# EAGLE design URA (EAGLE 9.6.2)
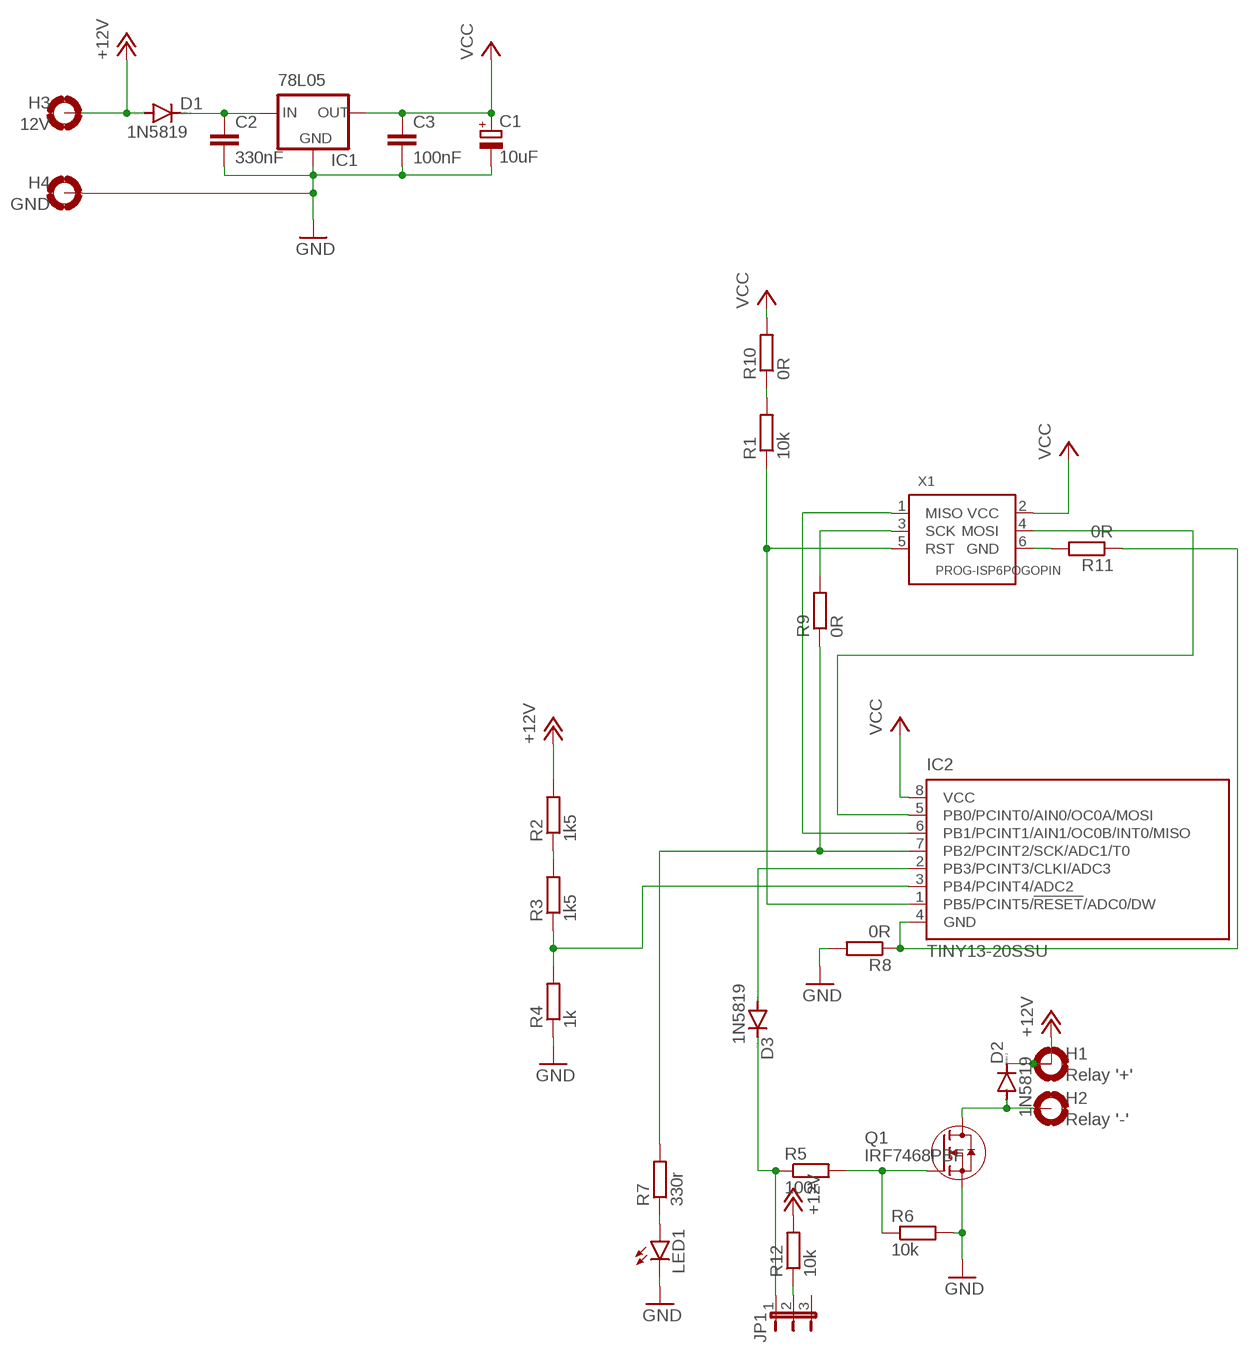
[diagram p0: schematic, sheet 1]

## Parts
C1  10uF  CPOL-EUCT3216  [CT3216]
C2  330nF  C-EUC0805K  [C0805K]
C3  100nF  C-EUC0805K  [C0805K]
D1  1N5819  CGRM4001-G  [SOD-123_MINI-SMA]
D2  1N5819  CGRM4001-G  [SOD-123_MINI-SMA]
D3  1N5819  CGRM4001-G  [SOD-123_MINI-SMA]
H1  Relay '+'  MOUNT-PAD-ROUND2.8  [2,8-PAD]
H2  Relay '-'  MOUNT-PAD-ROUND2.8  [2,8-PAD]
H3  12V  MOUNT-PAD-ROUND2.8  [2,8-PAD]
H4  GND  MOUNT-PAD-ROUND2.8  [2,8-PAD]
IC1  78L05  78LXXSOT89  [78LXX-SOT89]
IC2  TINY13-20SSU  [8S1]
JP1  JP2E  [JP2]
LED1  LEDCHIP-LED0805  [CHIP-LED0805]
Q1  IRF7468PBF  [SO08]
R1  10k  R-EU_R0805  [R0805]
R2  1k5  R-EU_R0805  [R0805]
R3  1k5  R-EU_R0805  [R0805]
R4  1k  R-EU_R0805  [R0805]
R5  100r  R-EU_R0805  [R0805]
R6  10k  R-EU_R0805  [R0805]
R7  330r  R-EU_R0805  [R0805]
R8  0R  R0_1206  [R1206]
R9  0R  R0_1206  [R1206]
R10  0R  R0_1206  [R1206]
R11  0R  R0_1206  [R1206]
R12  10k  R-EU_R0805  [R0805]
X1  PROG-ISP6POGOPIN  [PROG_POGOPIN]

## Nets
+12V: D1.A D2.C H1.B2,8(MOUNT) H3.B2,8(MOUNT) R2.2 R12.2
GND: C1.- C2.2 C3.2 H4.B2,8(MOUNT) IC1.GND@0(GND) IC1.GND@1(GND) LED1.C Q1.1(S) Q1.2(S) Q1.3(S) R4.1 R6.2 R8.2
N$1: IC2.6(PB1/PCINT1/AIN1/OC0B/INT0/MISO) X1.1(MISO)
N$2: IC2.5(PB0/PCINT0/AIN0/OC0A/MOSI) X1.4(MOSI)
N$3: IC2.1(PB5/PCINT5/!RESET!/ADC0/DW) R1.1 X1.5(RST)
N$4: C2.1 D1.C IC1.IN
N$5: IC2.7(PB2/PCINT2/SCK/ADC1/T0) R7.2 R9.1
N$6: R2.1 R3.2
N$7: IC2.3(PB4/PCINT4/ADC2) R3.1 R4.2
N$8: Q1.4(G) R5.2 R6.1
N$9: D3.A IC2.2(PB3/PCINT3/CLKI/ADC3)
N$10: D2.A H2.B2,8(MOUNT) Q1.5(D) Q1.6(D) Q1.7(D) Q1.8(D)
N$11: LED1.A R7.1
N$12: D3.C JP1.1 R5.1
N$13: R9.2 X1.3(SCK)
N$14: R1.2 R10.1
N$15: R11.2 X1.6(GND)
N$16: IC2.4(GND) R8.1 R11.1
N$27: JP1.2 R12.1
VCC: C1.+ C3.1 IC1.OUT IC2.8(VCC) R10.2 X1.2(VCC)
Unconnected: JP1.3

## Library data of the parts
C1 = rcl:CPOL-EU: POLARIZED CAPACITOR, European symbol; SPICEPREFIX: C
C2 C3 = rcl:C-EU: CAPACITOR, European symbol; SPICEPREFIX: C
D1-D3 = diode:CGRM400*-G: Molded plasitc,JEDEC SOD-123/Mini SMA Source: Comchip CGRM4001-G.pdf
H1-H4 = holes:MOUNT-PAD-ROUND: MOUNTING PAD, round
IC1 = usb:78LXX: VOLTAGE REGULATOR
IC2 = usb:TINY13: 8-bit AVR Microcontroller with 1K Bytes In-System Programmable Flash Source: http://www.atmel.com/dyn/resources/prod_documents/2535S.pdf; MPN: ATTINY13-20SSU; OC_FARNELL: 1455133; OC_NEWARK: 58M3771
JP1 = jumper:JP2E: JUMPER
LED1 = led:LED: LED OSRAM: - CHIPLED LG R971, LG N971, LY N971, LG Q971, LY Q971, LO R971, LY R971 LH N974, LH R974 LS Q976, LO Q976, LY Q976 LO Q996 - Hyper CHIPLED LW Q18S LB Q993, LB Q99A, LB R99A - SideLED LS A670, LO A670, LY A670, LG A670, LP A670 LB A673, LV A673, LT A673, LW A673 LH A674 LY A675 LS A676, LA A676, LO A676, LY A676, LW A676 LS A679, LY A679, LG A679 - Hyper Micro SIDELED® LS Y876, LA Y876, LO Y876, LY Y876 LT Y87S - SmartLED LW L88C, LW L88S LB L89C, LB L89S, LG L890 LS L89K, LO L89K, LY L89K LS L896, LA L896, LO L896, LY L896 - TOPLED LS T670, LO T670, LY T670, LG T670, LP T670 LSG T670, LSP T670, LSY T670, LOP T670, LYG T670 LG T671, LOG T671, LSG T671 LB T673, LV T673, LT T673, LW T673 LH T674 LS T676, LA T676, LO T676, LY T676, LB T676, LH T676, LSB T676, LW T676 LB T67C, LV T67C, LT T67C, LS T67K, LO T67K, LY T67K, LW E67C LS E67B, LA E67B, LO E67B, LY E67B, LB E67C, LV E67C, LT E67C LW T67C LS T679, LY T679, LG T679 LS T770, LO T770, LY T770, LG T770, LP T770 LB T773, LV T773, LT T773, LW T773 LH T774 LS E675, LA E675, LY E675, LS T675 LS T776, LA T776, LO T776, LY T776, LB T776 LHGB T686 LT T68C, LB T68C - Hyper Mini TOPLED® LB M676 - Mini TOPLED Santana® LG M470 LS M47K, LO M47K, LY M47K Source: http://www.osram.convergy.de LUXEON: - LUMILED® LXK2-PW12-R00, LXK2-PW12-S00, LXK2-PW14-U00, LXK2-PW14-V00 LXK2-PM12-R00, LXK2-PM12-S00, LXK2-PM14-U00 LXK2-PE12-Q00, LXK2-PE12-R00, LXK2-PE12-S00, LXK2-PE14-T00, LXK2-PE14-U00 LXK2-PB12-K00, LXK2-PB12-L00, LXK2-PB12-M00, LXK2-PB14-N00, LXK2-PB14-P00, LXK2-PB14-Q00 LXK2-PR12-L00, LXK2-PR12-M00, LXK2-PR14-Q00, LXK2-PR14-R00 LXK2-PD12-Q00, LXK2-PD12-R00, LXK2-PD12-S00 LXK2-PH12-R00, LXK2-PH12-S00 LXK2-PL12-P00, LXK2-PL12-Q00, LXK2-PL12-R00 Source: www.luxeon.com KINGBRIGHT: KA-3528ASYC Source: www.kingbright.com
Q1 = usb:IRF7468PBF
R1-R7 R12 = rcl:R-EU_: RESISTOR, European symbol; SPICEPREFIX: R
R8-R11 = usb:R0_1206
X1 = usb:PROG-ISP

## Board
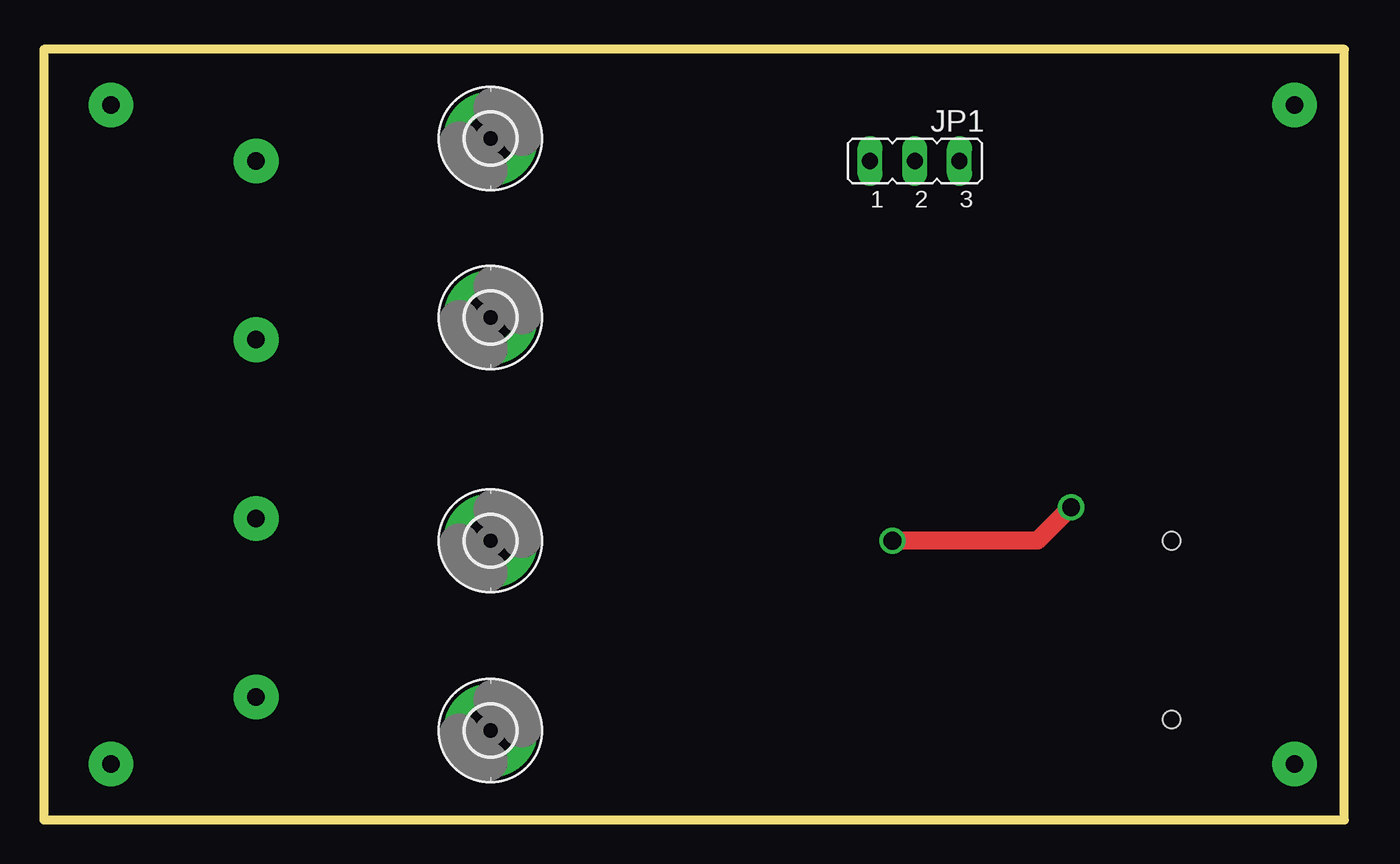
[diagram p1: board, top side]
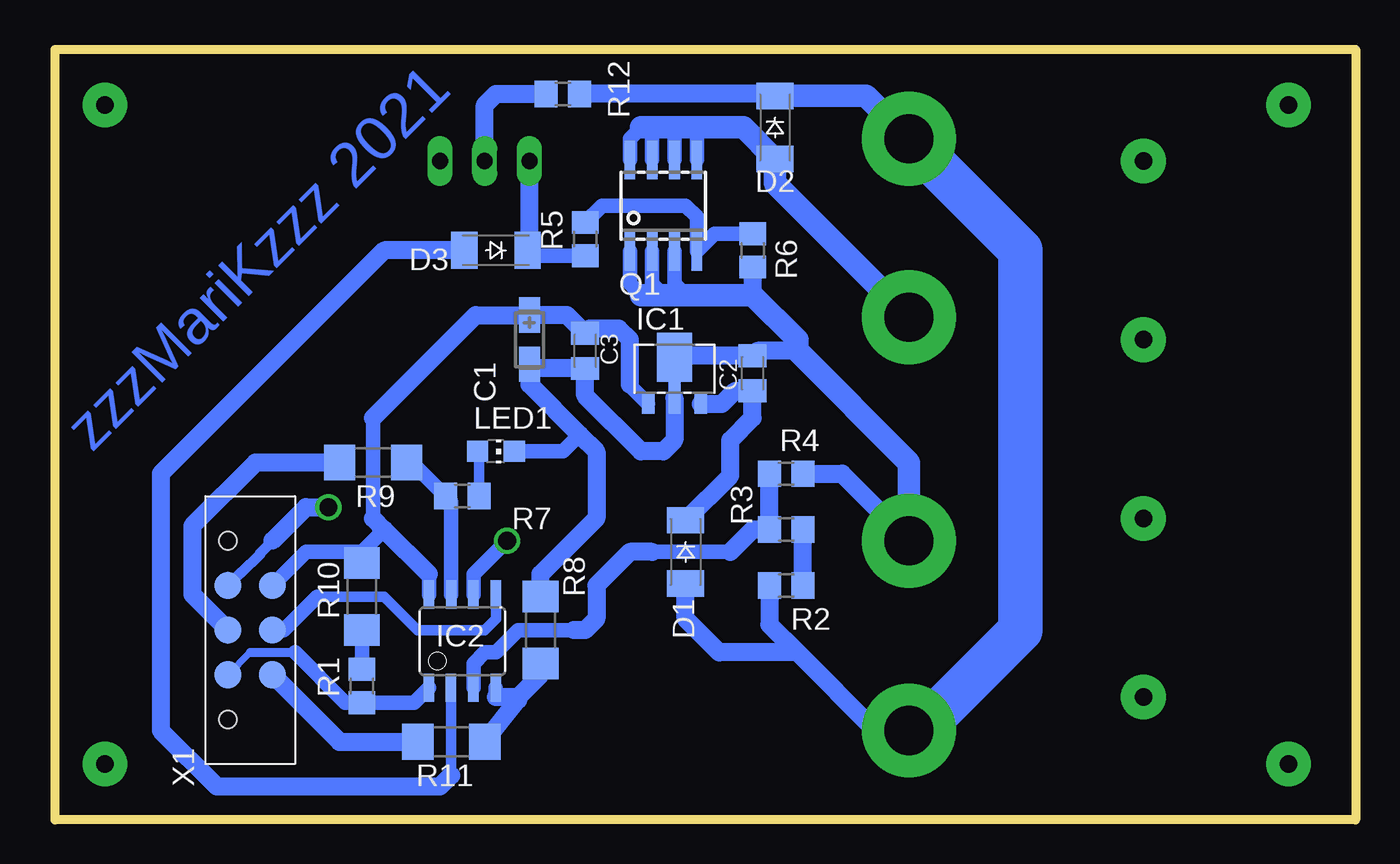
[diagram p2: board, bottom side, seen from below]

Size 73.97 x 43.8 mm. Coordinates in mm from the lower left corner, seen from the top.
Outline: 0,0 73.97,0 73.97,43.8 0,43.8 0,0
Copper layers (1*16): Top 0.035mm / dielectric 1.5mm / Bottom 0.035mm
Design rules "default": minimum track width 6mil, minimum drill 0.35mm, track to track 6mil, track to pad 6mil, pad to pad 6mil, via to via 6mil, smd to smd 6mil, copper to edge 40mil, drill to drill 6mil, minimum pad ring 10mil, minimum via ring 8mil, stop-mask expansion 4mil, vias tented up to drill 0mil, thermal gap 10mil

### Footprints (pad centres in the part's own frame; a part is rotated, then mirrored left to right if it is on the bottom)
CT3216 = smd 2 x 1.2: + -1.4,0; - 1.4,0
C0805K = smd 1.3 x 1.6: 1 -1,0; 2 1,0
SOD-123_MINI-SMA = smd 1.5 x 2.1: A 1.8,0; C -1.8,0
2,8-PAD = drill 2.8 pad 5.334: B2,8 0,0
78LXX-SOT89 = smd 0.7 x 1.8: GND@0 0,-1.4 | smd 2 x 2.8: GND@1 0,0.9 | smd 0.7 x 1.1: IN 1.5,-1.75; OUT -1.5,-1.75
8S1 = smd 0.6 x 1.6: 1 -1.905,-2.654; 2 -0.645,-2.654; 3 0.625,-2.654; 4 1.895,-2.654; 5 1.905,2.654; 6 0.635,2.654; 7 -0.635,2.654; 8 -1.905,2.654
JP2 = drill 0.914 long: 1 -2.54,0; 2 0,0; 3 2.54,0
CHIP-LED0805 = smd 1.2 x 1.2: A 0,-1.05; C 0,1.05
SO08 = smd 0.6 x 2.2: 1 -1.905,-2.6; 2 -0.635,-2.6; 3 0.635,-2.6; 4 1.905,-2.6; 5 1.905,2.6; 6 0.635,2.6; 7 -0.635,2.6; 8 -1.905,2.6
R0805 = smd 1.3 x 1.5: 1 -0.95,0; 2 0.95,0
R1206 = smd 1.778 x 2.032: 1 -1.905,0; 2 1.905,0
PROG_POGOPIN = smd 1.524 x 1.524: 1 0,7.62; 2 2.54,7.62; 3 0,5.08; 4 2.54,5.08; 5 0,2.54; 6 2.54,2.54 | hole 1.016: 0,0; 0,10.16

### Placement (x,y rotation side)
C1  46.99,27.3 270 bottom
C2  34.29,25.4 90 bottom
C3  43.81,26.67 270 bottom
D1  38.1,15.24 270 bottom
D2  33.02,39.37 270 bottom
D3  48.9,32.38 180 bottom
H1  25.4,38.73 0 top
H2  25.4,28.57 0 top
H3  25.4,5.08 0 top
H4  25.4,15.88 0 top
IC1  38.73,25.4 0 bottom
IC2  50.8,10.16 0 bottom
JP1  49.53,37.47 0 top
LED1  48.9,20.95 270 bottom
Q1  39.37,34.92 0 bottom
R1  56.52,7.62 90 bottom
R2  32.38,13.34 180 bottom
R3  32.38,16.51 0 bottom
R4  32.38,19.68 180 bottom
R5  43.81,33.02 90 bottom
R6  34.29,32.38 270 bottom
R7  50.8,18.41 180 bottom
R8  46.35,10.79 90 bottom
R9  55.88,20.32 180 bottom
R10  56.52,12.7 90 bottom
R11  51.44,4.45 180 bottom
R12  45.09,41.27 0 bottom
X1  64.14,5.71 0 bottom

### Tracks (layer width: path | path; a pad name or v marks a point on that pad's centre or on a via)
+12V
  Bottom 1.016: H3.B2,8 27.3,5.08 31.75,9.53 | 31.75,9.53 36.2,9.53 38.1,11.43 D1.A | R2.2 33.34,11.11 31.75,9.53 | D2.C 33.12,41.27 R12.2
  Bottom 1.27: H1.B2,8 27.84,41.17 D2.C
  Bottom 2.54: H1.B2,8 19.05,32.38 19.05,10.79 24.77,5.08 H3.B2,8
GND
  Bottom 0.406: IC1.GND@0 IC1.GND@1
  Bottom 0.813: 40.64,29.84 41.27,30.48 Q1.1 | Q1.2 40.01,30.48 39.37,29.84 | Q1.3 38.73,30.48 38.1,29.84 | LED1.C 45.09,20.95 44.13,21.91
  Bottom 1.016: IC1.GND@1 38.84,26.4 C2.2 34.02,26.67 31.75,26.67 | IC1.GND@0 38.73,21.59 39.37,20.95 40.64,20.95 43.81,24.13 C3.2 46.76,25.67 C1.- 46.99,24.77 44.13,21.91 43.18,20.95 43.18,17.14 46.35,13.97 R8.2 | R4.1 29.21,19.68 H4.B2,8 | R6.2 34.29,29.84
  Bottom 1.27: 40.64,29.84 39.37,29.84 38.1,29.84 34.29,29.84 31.75,27.3 31.75,26.67 25.4,20.32 H4.B2,8
N$1  (via drill 1)
  Top 1.016: v58.42,17.78 56.52,15.88 v48.26,15.88
  Bottom 0.61: X1.1 63.42,14.05 63.38,14.05 62.31,15.12 62.31,15.16 61.59,15.88
  Bottom 0.813: v48.26,15.88 50.16,13.97 IC2.6
  Bottom 1.016: 61.59,15.88 59.69,17.78 v58.42,17.78
N$2
  Bottom 0.61: 59.05,12.7 55.24,12.7 53.34,10.79 49.53,10.79 48.9,11.43 IC2.5
  Bottom 0.813: X1.4 60.96,10.79 59.05,12.7
N$3
  Bottom 0.406: X1.5 62.87,9.53
  Bottom 0.508: 62.87,9.53 60.33,9.53
  Bottom 0.813: IC2.1 53.54,6.67 R1.1 57.47,6.67 60.33,9.53
N$4
  Bottom 1.016: IC1.IN 36.04,23.65 35.29,24.4 C2.1 34.29,22.86 35.56,21.59 35.56,19.58 D1.C
N$5
  Bottom 0.813: R9.1 53.66,20.32 R7.2 51.44,18.1 IC2.7
N$6
  Bottom 1.016: R2.1 R3.2
N$7
  Bottom 0.813: 35.56,15.24 40.01,15.24 | 44.45,10.79 47.62,10.79 48.9,9.53 49.53,9.53 50.17,8.88 IC2.3
  Bottom 1.016: R4.2 R3.1 34.29,16.51 35.56,15.24 | 40.01,15.24 41.27,15.24 43.18,13.34 43.18,11.43 43.81,10.79 44.45,10.79
N$8
  Bottom 0.813: R6.1 36.45,33.34 Q1.4 37.47,34.29 38.1,34.92 42.86,34.92 R5.2
N$9
  Bottom 0.61: 51.44,2.54 51.44,7.5 IC2.2
  Bottom 1.016: D3.A 55.24,32.38 67.94,19.68 67.94,5.08 64.77,1.91 52.07,1.91 51.44,2.54
N$10
  Bottom 0.813: 40.64,39.37 41.27,38.73 Q1.8 | Q1.7 40.01,39.37 | Q1.6 38.73,39.37 | Q1.5 37.47,39.37
  Bottom 1.27: H2.B2,8 33.02,36.2 D2.A 34.82,39.37 37.47,39.37 38.73,39.37 40.01,39.37 40.64,39.37
N$11
  Bottom 0.61: R7.1 49.85,20.86 LED1.A
N$12
  Bottom 0.813: R5.1 46.78,32.07 D3.C
  Bottom 1.016: D3.C 46.99,32.49 JP1.1
N$13
  Bottom 1.016: R9.2 62.56,20.32 66.17,16.72 66.17,12.83 X1.3
N$14
  Bottom 0.813: R1.2 R10.1
N$15
  Bottom 1.016: X1.6 57.78,4.45 R11.2
N$16
  Bottom 0.813: 48.9,6.99 48.91,7 IC2.4
  Bottom 1.016: R8.1 46.35,8.26 47.62,6.99 | 47.62,6.99 48.9,6.99 | R11.1 47.62,6.83 47.62,6.99
N$17  (via drill 1 pad 2.54)
  other vias: 71.12,40.64
N$18  (via drill 1 pad 2.54)
  other vias: 71.12,3.17
N$19  (via drill 1 pad 2.54)
  other vias: 3.81,40.64
N$20  (via drill 1 pad 2.54)
  other vias: 3.81,3.17
N$21  (via drill 1 pad 2.54)
  other vias: 12.06,6.99
N$22  (via drill 1 pad 2.54)
  other vias: 12.06,17.14
N$23  (via drill 1 pad 2.54)
  other vias: 12.06,27.3
N$24  (via drill 1 pad 2.54)
  other vias: 12.06,37.47
N$25  (via drill 0.3 pad 1)
  other vias: 64.14,15.88
N$26  (via drill 0.3 pad 1)
  other vias: 64.14,5.71
N$27
  Bottom 1.016: JP1.2 49.53,40.64 48.9,41.27 R12.1
VCC
  Bottom 0.813: IC2.8 52.7,13.97 | IC1.OUT 41.27,24.69 41.27,24.77 | 55.88,17.14 55.88,22.86 | R10.2 56.52,15.24 | 56.52,15.24 55.24,16.51 | 56.52,15.24 59.69,15.24 X1.2
  Bottom 1.016: 41.27,24.77 41.27,27.3 41.91,27.94 43.55,27.94 C3.1 44.85,28.7 C1.+ 50.03,28.7 55.88,22.86 | 52.7,13.97 55.24,16.51 55.88,17.14

### Text on the board
Bottom: zzzMariKzzz 2021